# Altium project AMC_FMC_Carrier.PrjPcb (part 1 of 7)
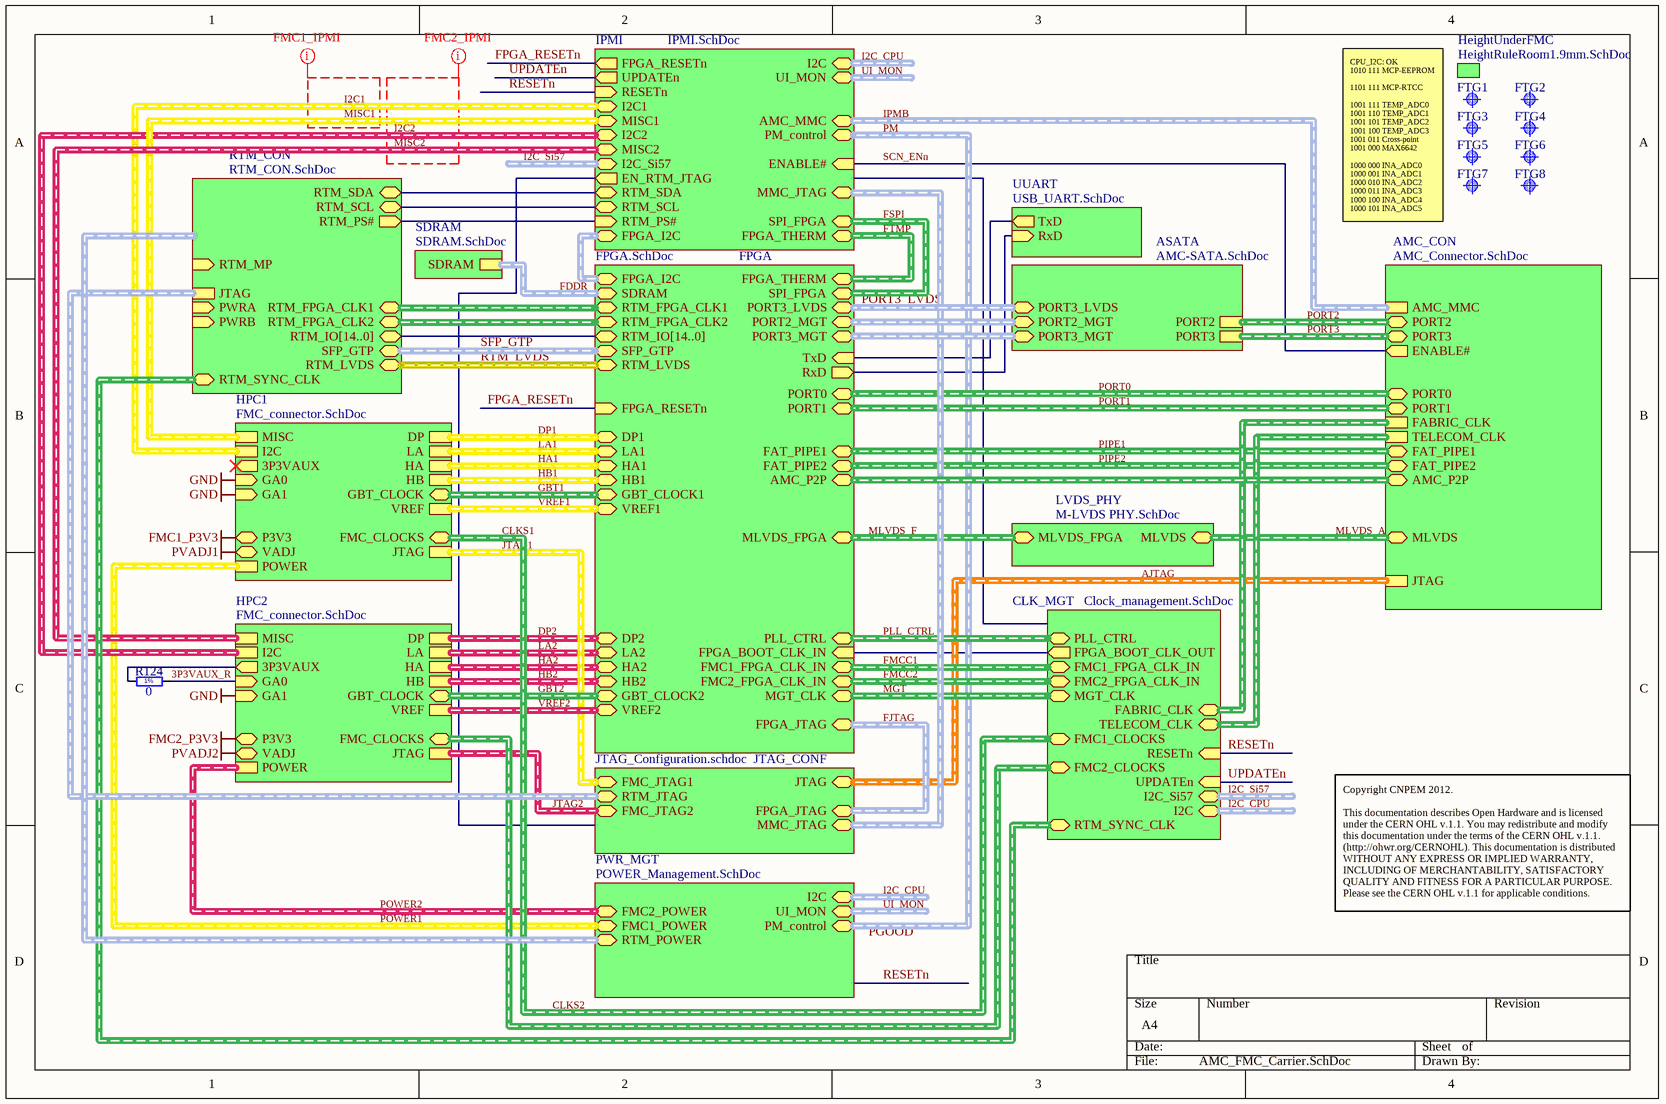
[diagram p0: AMC_FMC_Carrier.SchDoc]
21 sheets, 680 parts. Net scope: hierarchical (ports join the sheet entries above them; power ports are global).
Board file: AMC_FMC_Carrier.PcbDoc
Sheets:
  AMC_FMC_Carrier.SchDoc
    AMC_CON = AMC_Connector.SchDoc
    FPGA = FPGA.SchDoc
      FSDRAM = FPGA_SDRAM.SchDoc
    PWR_MGT = Power_Management.SchDoc
      SUP_HPC25 = SUP_2.5_FMC.SchDoc
      SUP_HPC33 = SUP_3.3_FMC.SchDoc
      SUP_15 = SUP_1.5_3.3.SchDoc
      SUP_10 = SUP_1V.SchDoc
      UI = UI_mon.SchDoc
      Connector Power = Connector_Power.SchDoc
    IPMI = IPMI.SchDoc
      CPU = CPU.SchDoc
      THERMO = Thermometers.SchDoc
      UUART = USB_UART.SchDoc
    JTAG_CONF = JTAG_Configuration.SchDoc
    RTM_CON = RTM_CON.SchDoc
    CLK_MGT = Clock_management.SchDoc
      CLK_WR = Clock_WR.SchDoc
    UUART = USB_UART.SchDoc
  FMC_Clocks.SchDoc
  SUP_1.5_VTT.SchDoc

## Sheet AMC_FMC_Carrier.SchDoc
size A4; DocumentNumber: 2; SheetNumber: 2; SheetTotal: 30

### Parts
FTG1  Use only in PCB  [FIDUCIAL_TOP_S100-200]  (value not drawn)
FTG2  Use only in PCB  [FIDUCIAL_TOP_C100-200]  (value not drawn)
FTG3  Use only in PCB  [FIDUCIAL_TOP_S100-200]  (value not drawn)
FTG4  Use only in PCB  [FIDUCIAL_TOP_C100-200]  (value not drawn)
FTG5  Use only in PCB  [FIDUCIAL_TOP_S100-200]  (value not drawn)
FTG6  Use only in PCB  [FIDUCIAL_TOP_C100-200]  (value not drawn)
FTG7  Use only in PCB  [FIDUCIAL_TOP_S100-200]  (value not drawn)
FTG8  Use only in PCB  [FIDUCIAL_TOP_C100-200]  (value not drawn)
R124  0  [RESC1005X40N]

### Sub-sheets
AMC_CON = AMC_Connector.SchDoc: JTAG (harness AMC_JTAG), TELECOM_CLK (harness AMC_TELECOM_CLOCK), FABRIC_CLK (harness AMC_FABRIC_CLOCK), AMC_MMC (harness I2C), ENABLE# (out), PORT0 (harness PORT0), PORT1 (harness PORT1), PORT2 (harness PORT2), PORT3 (harness PORT3), FAT_PIPE1 (harness FAT_PIPE1), FAT_PIPE2 (harness FAT_PIPE2), MLVDS (harness MLVDS), AMC_P2P (harness AMC_P2P)
ASATA = AMC-SATA.SchDoc (file not in this document): PORT2 (harness PORT2), PORT3 (harness PORT3), PORT2_MGT (harness PORT2), PORT3_MGT (harness PORT3), PORT3_LVDS (harness PORT3)
CLK_MGT = Clock_management.SchDoc: FABRIC_CLK (harness AMC_FABRIC_CLOCK), TELECOM_CLK (harness AMC_TELECOM_CLOCK), FMC1_CLOCKS (harness FMC_CLOCKS), FMC2_CLOCKS (harness FMC_CLOCKS), MGT_CLK (harness MGT_CLK), FMC1_FPGA_CLK_IN (harness FMC_FPGA_CLK_IN), FMC2_FPGA_CLK_IN (harness FMC_FPGA_CLK_IN), PLL_CTRL (harness PLL_CTRL), RESETn (in), UPDATEn (in), I2C (harness I2C), RTM_SYNC_CLK (harness CLK_DIFF), I2C_Si57 (harness I2C), FPGA_BOOT_CLK_OUT (out)
FPGA = FPGA.SchDoc: SDRAM (harness DDR), FPGA_JTAG (harness FMC_J1_JTAG), VREF2 (harness FMC_J1_VREF), VREF1 (harness FMC_J1_VREF), FPGA_THERM (harness FPGA_THERM), SPI_FPGA (harness SPI), FAT_PIPE1, FAT_PIPE2, PORT1, PORT0, MLVDS_FPGA, GBT_CLOCK1, GBT_CLOCK2, MGT_CLK, FMC1_FPGA_CLK_IN, FMC2_FPGA_CLK_IN, PLL_CTRL (harness PLL_CTRL), FPGA_RESETn (in), LA1, HA1, HB1, LA2, HA2, HB2, DP1, DP2, PORT2_MGT (harness PORT2), PORT3_MGT (harness PORT3), RxD (out), TxD (in), RTM_IO[14..0] (bidir), RTM_LVDS (harness RTM_LVDS), SFP_GTP (harness SFP_GTP), RTM_FPGA_CLK1 (harness CLK_DIFF), RTM_FPGA_CLK2 (harness CLK_DIFF), PORT3_LVDS (harness PORT3), AMC_P2P (harness AMC_P2P), FPGA_I2C (harness I2C), FPGA_BOOT_CLK_IN (in)
HeightUnderFMC = HeightRuleRoom1.9mm.SchDoc (file not in this document): no entries
HPC1 = FMC_connector.SchDoc (file not in this document): DP (harness FMC_J1_DP), LA (harness FMC_J1_LA), HA (harness FMC_J1_HA), HB (harness FMC_J1_HB), MISC (harness MISC), POWER (harness FMC_J1_POWER), JTAG (harness FMC_J1_JTAG), I2C (harness I2C), GA0 (in), GA1 (in), 3P3VAUX (out), VREF (harness FMC_J1_VREF), FMC_CLOCKS (harness FMC_CLOCKS), GBT_CLOCK (harness GBT_CLOCK), VADJ, P3V3
HPC2 = FMC_connector.SchDoc (file not in this document): DP (harness FMC_J1_DP), LA (harness FMC_J1_LA), HA (harness FMC_J1_HA), HB (harness FMC_J1_HB), MISC (harness MISC), POWER (harness FMC_J1_POWER), JTAG (harness FMC_J1_JTAG), I2C (harness I2C), VREF (harness FMC_J1_VREF), GA0 (in), GA1 (in), 3P3VAUX (out), FMC_CLOCKS (harness FMC_CLOCKS), GBT_CLOCK (harness GBT_CLOCK), VADJ, P3V3
IPMI = IPMI.SchDoc: I2C1 (harness I2C), I2C2 (harness I2C), MISC1 (harness MISC), MISC2 (harness MISC), PM_control (harness pm_control), FPGA_THERM (harness FPGA_THERM), SPI_FPGA (harness SPI), ENABLE# (in), UPDATEn (out), RESETn (in), I2C (harness I2C), FPGA_RESETn (out), RTM_SDA (bidir), RTM_SCL (bidir), RTM_PS# (in), EN_RTM_JTAG (out), I2C_Si57 (harness I2C), FPGA_I2C (harness I2C), MMC_JTAG, AMC_MMC (harness AMC_MMC), UI_MON
JTAG_CONF = JTAG_Configuration.schdoc: FMC_JTAG1 (harness FMC_J1_JTAG), FMC_JTAG2 (harness FMC_J1_JTAG), JTAG (harness AMC_JTAG), RTM_JTAG (harness RTM_JTAG), MMC_JTAG (harness MMC_JTAG), FPGA_JTAG (harness FPGA_JTAG)
LVDS_PHY = M-LVDS PHY.SchDoc (file not in this document): MLVDS (harness MLVDS), MLVDS_FPGA (harness MLVDS-FPGA)
PWR_MGT = POWER_Management.SchDoc: FMC1_POWER, FMC2_POWER, PM_control (harness PM_control), I2C (harness I2C), RTM_POWER, UI_MON
RTM_CON = RTM_CON.SchDoc: RTM_IO[14..0] (bidir, harness JTAG), RTM_LVDS (harness RTM_LVDS), PWRA (in), PWRB (in), RTM_PS# (out), RTM_SDA (bidir), RTM_SCL (bidir), RTM_MP (in), RTM_SYNC_CLK (harness CLK_DIFF), SFP_GTP (harness SFP_GTP), JTAG (harness FMC_J1_JTAG), RTM_FPGA_CLK1 (harness CLK_DIFF), RTM_FPGA_CLK2 (harness CLK_DIFF)
SDRAM = SDRAM.SchDoc (file not in this document): SDRAM (harness DDR)
UUART = USB_UART.SchDoc: TxD (out), RxD (in)

### Nets
GND: sheet HPC1/GA0, sheet HPC1/GA1, sheet HPC2/GA1
3P3VAUX_R: R124.2 ; sheet HPC2/GA0
FPGA_BOOT_CLK_IN: sheet FPGA/FPGA_BOOT_CLK_IN, sheet CLK_MGT/FPGA_BOOT_CLK_OUT
FPGA_RESETn: sheet FPGA/FPGA_RESETn, sheet IPMI/FPGA_RESETn
RESETn: sheet IPMI/RESETn, sheet CLK_MGT/RESETn
RTM_PS#: sheet IPMI/RTM_PS#, sheet RTM_CON/RTM_PS#
RTM_SCL: sheet IPMI/RTM_SCL, sheet RTM_CON/RTM_SCL
RTM_SDA: sheet IPMI/RTM_SDA, sheet RTM_CON/RTM_SDA
RxD: sheet FPGA/RxD, sheet UUART/RxD
SCN_ENn: sheet AMC_CON/ENABLE#, sheet IPMI/ENABLE#
TxD: sheet FPGA/TxD, sheet UUART/TxD
UPDATEn: sheet IPMI/UPDATEn, sheet CLK_MGT/UPDATEn
NetR124_1: R124.1 ; sheet HPC2/3P3VAUX

### Buses and harness runs
harness AJTAG = sheet AMC_CON/JTAG = sheet JTAG_CONF/JTAG
harness CLKS1 = CLKS2 = sheet CLK_MGT/FMC1_CLOCKS = sheet HPC1/FMC_CLOCKS
harness DP1 = sheet FPGA/DP1 = sheet HPC1/DP
harness DP2 = sheet FPGA/DP2 = sheet HPC2/DP
harness FDDR = sheet FPGA/SDRAM = sheet SDRAM/SDRAM
harness FJTAG = sheet FPGA/FPGA_JTAG = sheet JTAG_CONF/FPGA_JTAG
harness FMCC1 = sheet CLK_MGT/FMC1_FPGA_CLK_IN = sheet FPGA/FMC1_FPGA_CLK_IN
harness FMCC2 = sheet CLK_MGT/FMC2_FPGA_CLK_IN = sheet FPGA/FMC2_FPGA_CLK_IN
harness FSPI = sheet FPGA/SPI_FPGA = sheet IPMI/SPI_FPGA
harness FTMP = sheet FPGA/FPGA_THERM = sheet IPMI/FPGA_THERM
harness GBT1 = sheet FPGA/GBT_CLOCK1 = sheet HPC1/GBT_CLOCK
harness GBT2 = sheet FPGA/GBT_CLOCK2 = sheet HPC2/GBT_CLOCK
harness HA1 = sheet FPGA/HA1 = sheet HPC1/HA
harness HA2 = sheet FPGA/HA2 = sheet HPC2/HA
harness HB1 = sheet FPGA/HB1 = sheet HPC1/HB
harness HB2 = sheet FPGA/HB2 = sheet HPC2/HB
harness I2C1 = sheet HPC1/I2C = sheet IPMI/I2C1
harness I2C2 = sheet HPC2/I2C = sheet IPMI/I2C2
harness I2C_CPU = sheet CLK_MGT/I2C
harness I2C_CPU = sheet IPMI/I2C
harness I2C_CPU = sheet PWR_MGT/I2C
harness I2C_Si57 = sheet CLK_MGT/I2C_Si57
harness I2C_Si57 = sheet IPMI/I2C_Si57
harness IPMB = sheet AMC_CON/AMC_MMC = sheet IPMI/AMC_MMC
harness JTAG1 = sheet HPC1/JTAG = sheet JTAG_CONF/FMC_JTAG1
harness JTAG2 = sheet HPC2/JTAG = sheet JTAG_CONF/FMC_JTAG2
harness LA1 = sheet FPGA/LA1 = sheet HPC1/LA
harness LA2 = sheet FPGA/LA2 = sheet HPC2/LA
harness MGT = sheet CLK_MGT/MGT_CLK = sheet FPGA/MGT_CLK
harness MISC1 = sheet HPC1/MISC = sheet IPMI/MISC1
harness MISC2 = sheet HPC2/MISC = sheet IPMI/MISC2
harness MLVDS_A = sheet AMC_CON/MLVDS = sheet LVDS_PHY/MLVDS
harness MLVDS_F = sheet FPGA/MLVDS_FPGA = sheet LVDS_PHY/MLVDS_FPGA
harness PIPE1 = sheet AMC_CON/FAT_PIPE1 = sheet FPGA/FAT_PIPE1
harness PIPE2 = sheet AMC_CON/FAT_PIPE2 = sheet FPGA/FAT_PIPE2
harness PLL_CTRL = sheet CLK_MGT/PLL_CTRL = sheet FPGA/PLL_CTRL
harness PM = sheet IPMI/PM_control = sheet PWR_MGT/PM_control
harness PORT0 = sheet AMC_CON/PORT0 = sheet FPGA/PORT0
harness PORT1 = sheet AMC_CON/PORT1 = sheet FPGA/PORT1
harness PORT2 = sheet AMC_CON/PORT2 = sheet ASATA/PORT2
harness PORT3 = sheet AMC_CON/PORT3 = sheet ASATA/PORT3
harness PORT3_LVDS = sheet ASATA/PORT3_LVDS = sheet FPGA/PORT3_LVDS
harness POWER1 = sheet HPC1/POWER = sheet PWR_MGT/FMC1_POWER
harness POWER2 = sheet HPC2/POWER = sheet PWR_MGT/FMC2_POWER
harness RTM_LVDS = sheet FPGA/RTM_LVDS = sheet RTM_CON/RTM_LVDS
harness SFP_GTP = sheet FPGA/SFP_GTP = sheet RTM_CON/SFP_GTP
harness sheet AMC_CON/AMC_P2P = sheet FPGA/AMC_P2P
harness sheet AMC_CON/FABRIC_CLK = sheet CLK_MGT/FABRIC_CLK
harness sheet AMC_CON/TELECOM_CLK = sheet CLK_MGT/TELECOM_CLK
harness sheet ASATA/PORT2_MGT = sheet FPGA/PORT2_MGT
harness sheet ASATA/PORT3_MGT = sheet FPGA/PORT3_MGT
harness sheet CLK_MGT/FMC2_CLOCKS = sheet HPC2/FMC_CLOCKS
harness sheet CLK_MGT/RTM_SYNC_CLK = sheet RTM_CON/RTM_SYNC_CLK
harness sheet FPGA/FPGA_I2C = sheet IPMI/FPGA_I2C
harness sheet FPGA/RTM_FPGA_CLK1 = sheet RTM_CON/RTM_FPGA_CLK1
harness sheet FPGA/RTM_FPGA_CLK2 = sheet RTM_CON/RTM_FPGA_CLK2
harness sheet IPMI/MMC_JTAG = sheet JTAG_CONF/MMC_JTAG
harness sheet JTAG_CONF/RTM_JTAG = sheet RTM_CON/JTAG
harness UI_MON = sheet IPMI/UI_MON
harness UI_MON = sheet PWR_MGT/UI_MON
harness VREF1 = sheet FPGA/VREF1 = sheet HPC1/VREF
harness VREF2 = sheet FPGA/VREF2 = sheet HPC2/VREF

### Layout directives
net class FMC1_IPMI: I2C1, MISC1
net class FMC2_IPMI: I2C2, MISC2

### Notes on the sheet
- CPU_I2C: OK
  1010 111 MCP-EEPROM
  1101 111 MCP-RTCC
  1001 111 TEMP_ADC0
  1001 110 TEMP_ADC1
  1001 101 TEMP_ADC2
  1001 100 TEMP_ADC3
  1001 011 Cross-point
  1001 000 MAX6642
  1000 000 INA_ADC0
  1000 001 INA_ADC1
  1000 010 INA_ADC2
  1000 011 INA_ADC3
  1000 100 INA_ADC4
  1000 101 INA_ADC5
- Copyright CNPEM 2012.
  This documentation describes Open Hardware and is licensed under the CERN OHL v.1.1. You may redistribute and modify this documentation under the terms of the CERN OHL v.1.1. (http://ohwr.org/CERNOHL). This documentation is distributed WITHOUT ANY EXPRESS OR IMPLIED WARRANTY, INCLUDING OF MERCHANTABILITY, SATISFACTORY QUALITY AND FITNESS FOR A PARTICULAR PURPOSE. Please see the CERN OHL v.1.1 for applicable conditions.
- Labels drawn without touching a wire or pin: PGOOD
- (in symbol R0402_0R_JUMPER) 1%

### Library data of the parts
FTG1 FTG3 FTG5 FTG7 = FIDUCIAL_TARGET_S100-200: Fiducial Target; Part Description: Square Fiducial Target, Top Layer, 1.0mm, Top Solder 2.0mm, Keepout =2.0mm; Mounted: No; Table: Pads; Part Number: FIDUCIAL_TARGET_S100-200; Component Kind: Standard (No BOM); Component Type: Standard (No BOM); Pin Count: 1; Family: Fiducial; Socket: No; SMD: Yes; Status: None; ComponentHeight: 0mm; Author: CERN DEM JLC; CreateDate: 2010-02-09; LatestRevisionDate: 2012-04-04; PackageDescription: Square Fiducial Target, Top Layer, 1.0mm, Top Solder 2.0mm, Keepout =2.0mm
FTG2 FTG4 FTG6 FTG8 = FIDUCIAL_TARGET_C100-200: Fiducial Target; Part Description: Round Fiducial Target, Top Layer, 1.0mm, Top Solder 2.0mm, Keepout =2.0mm; Mounted: No; Table: Pads; Part Number: FIDUCIAL_TARGET_C100-200; Component Kind: Standard (No BOM); Component Type: Standard (No BOM); Pin Count: 1; Family: Fiducial; Socket: No; SMD: Yes; Status: None; ComponentHeight: 0mm; Author: CERN DEM JLC; CreateDate: 2010-02-09; LatestRevisionDate: 2012-04-04; PackageDescription: Round Fiducial Target, Top Layer, 1.0mm, Top Solder 2.0mm, Keepout =2.0mm
R124 = R0402_0R_JUMPER: Resistor - 1%; Part Description: 1A (0.05R Max DC Resistance) Zero Ohm Jumper; Manufacturer: GENERIC; Manufacturer1 Part Number: 232270591001L; Table: Resistors SMD; Part Number: R0402_0R_JUMPER; Component Kind: Standard; Component Type: Standard; Pin Count: 2; Value: 0; Status: Not recommended; Manufacturer Part Number: R0402_0R_JUMPER; Case: 0402; Mounted: Yes; Socket: No; SMD: Yes; Manufacturer1 Example: YAGEO PHYCOMP; Manufacturer1 ComponentHeight: 0.4mm; HelpURL: \\cern.ch\dfs\Applications\Altium\Datasheets\R0402_Phycomp_RC0402.pdf; Author: CERN DEM JLC; CreateDate: 2007-12-03; LatestRevisionDate: 2012-10-17

## Sheet AMC_Connector.SchDoc: AMC Top Sheet
size A3; DocumentNumber: 1; Revision: 5; SheetNumber: 1; SheetTotal: 30; Organization: Altium Limited.
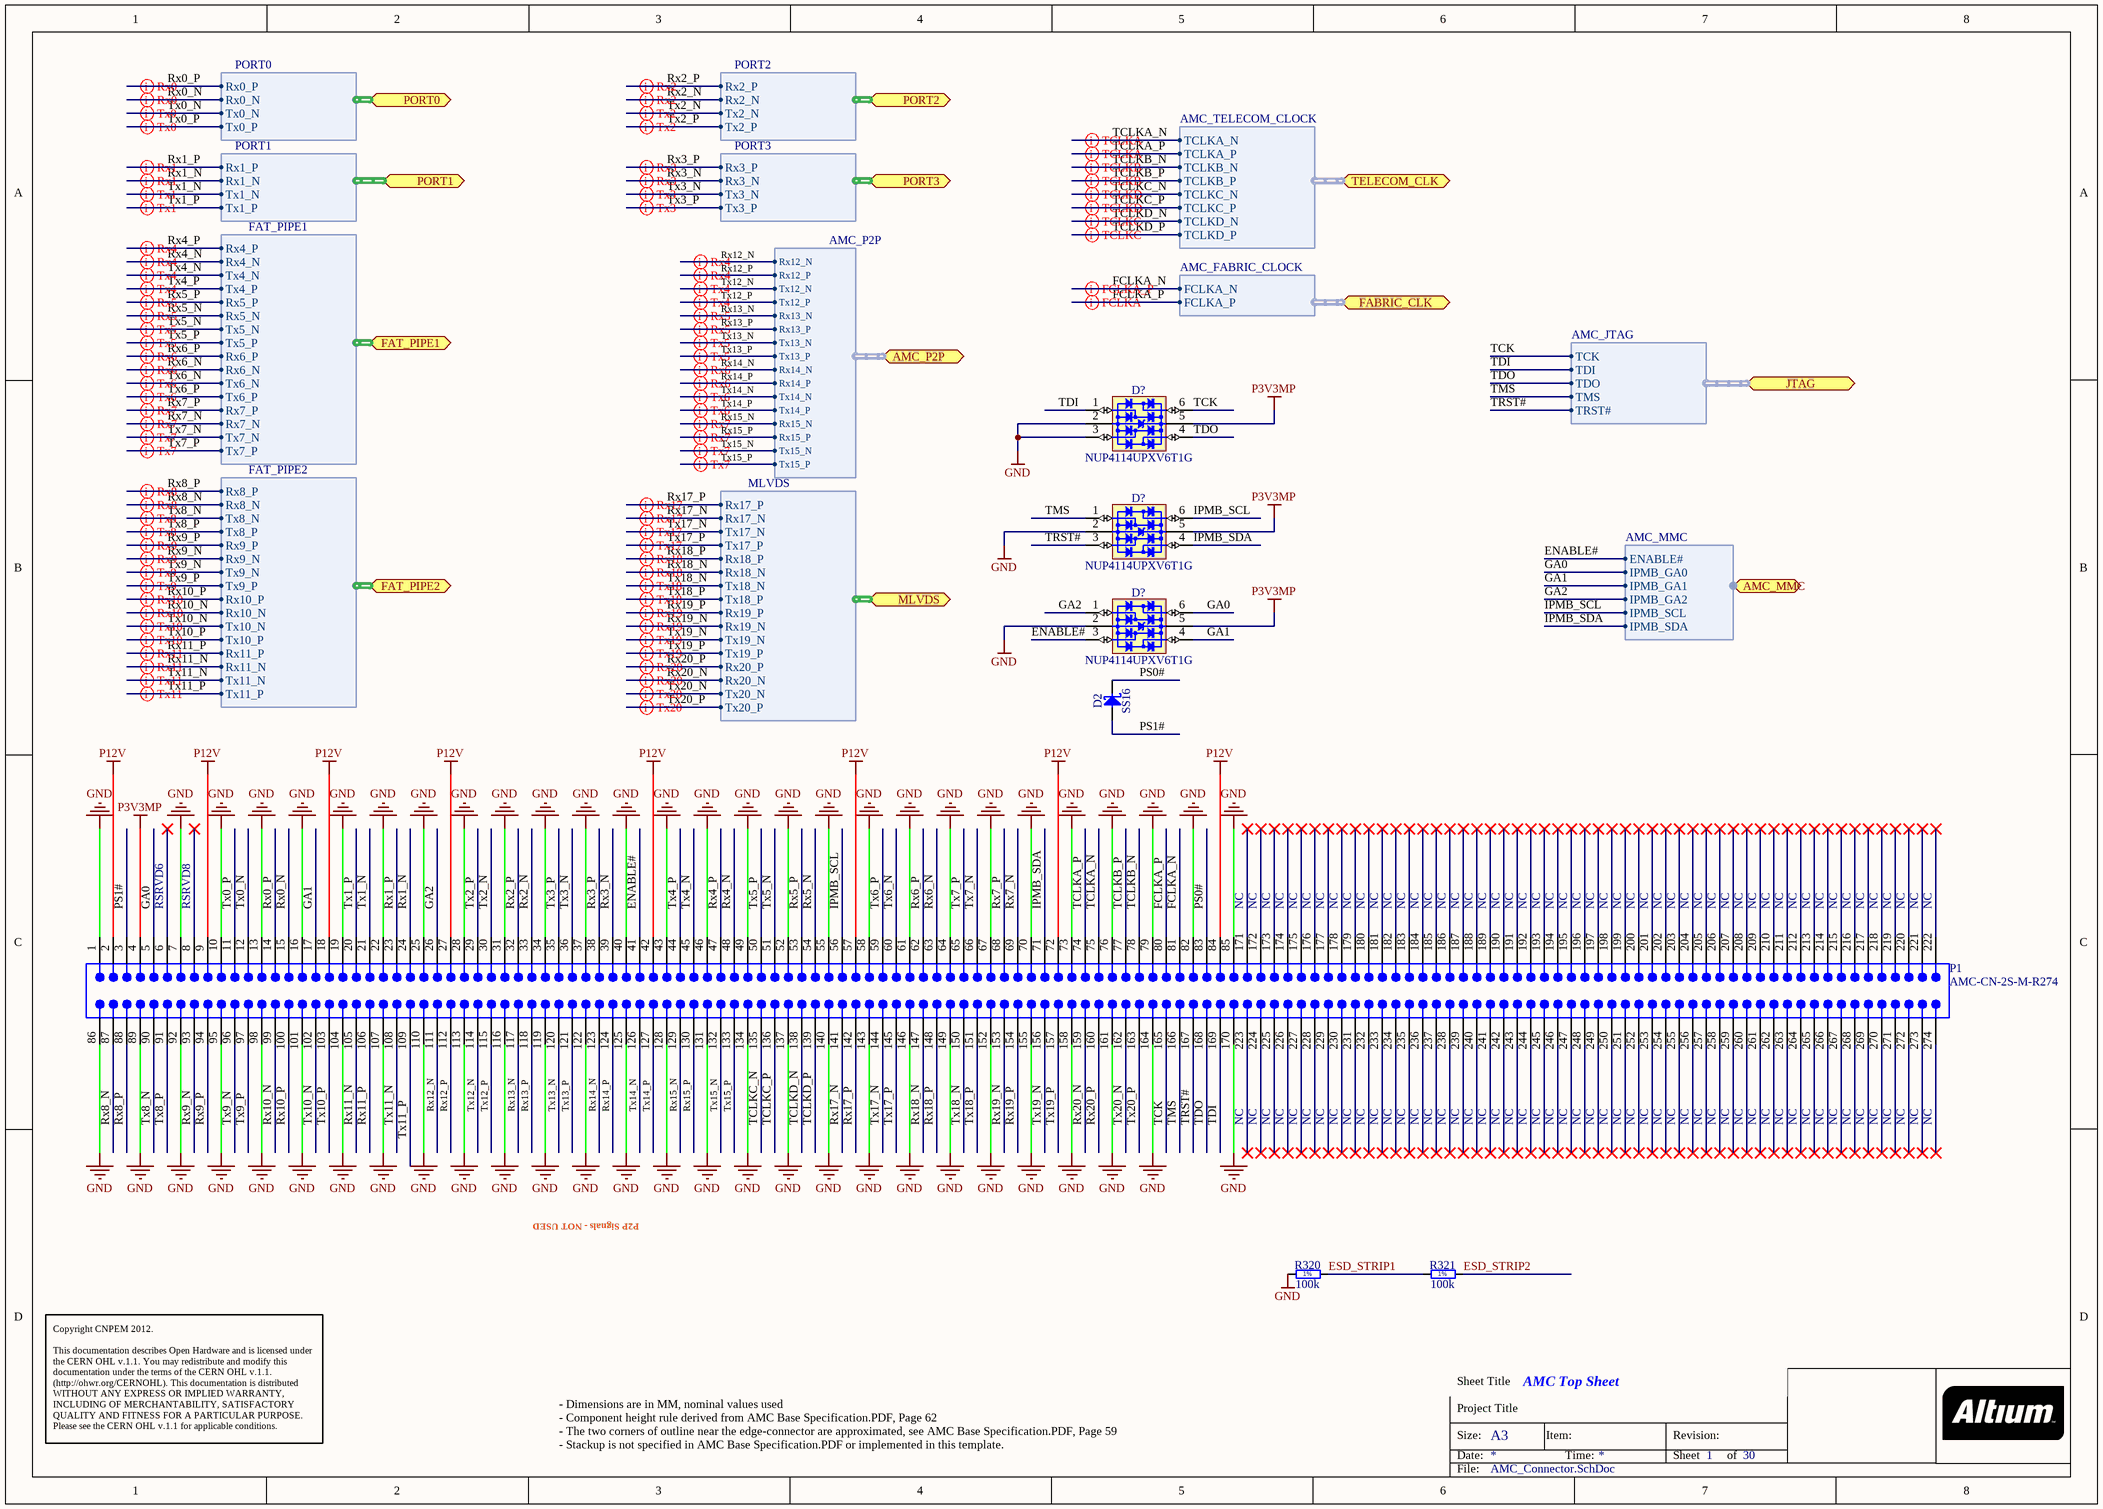
[diagram p1: AMC_Connector.SchDoc]

### Parts
(Parts that share a designator on the sheet are numbered #1, #2 ... from top to bottom, then left to right.)
D2#1  SS16  [DIOM5127X229N]
D?#1  NUP4114UPXV6T1G  [SOTFL50P160X60-6N]
D?#2  NUP4114UPXV6T1G  [SOTFL50P160X60-6N]
D?#3  NUP4114UPXV6T1G  [SOTFL50P160X60-6N]
P1  AMC-CN-2S-M-R274  [AMC-GF-2D-750-O274]  (no BOM)
R320  100k  [RESC3216X65N]
R321  100k  [RESC3216X65N]

### Ports
AMC_MMC (harness AMC_MMC), AMC_P2P (harness AMC_P2P), FABRIC_CLK (harness AMC_FABRIC_CLOCK), FAT_PIPE1 (harness FAT_PIPE1), FAT_PIPE2 (harness FAT_PIPE2), JTAG (harness AMC_JTAG), MLVDS (harness MLVDS), PORT0 (harness PORT0), PORT1 (harness PORT1), PORT2 (harness PORT2), PORT3 (harness PORT3), TELECOM_CLK (harness AMC_TELECOM_CLOCK)

### Harnesses
AMC_JTAG: TCK, TDI, TDO, TMS, TRST#
AMC_TELECOM_CLOCK: TCLKA_N, TCLKA_P, TCLKB_N, TCLKB_P, TCLKC_N, TCLKC_P, TCLKD_N, TCLKD_P
AMC_FABRIC_CLOCK: FCLKA_N, FCLKA_P
PORT0: Rx0_P, Rx0_N, Tx0_N, Tx0_P
PORT1: Rx1_P, Rx1_N, Tx1_N, Tx1_P
FAT_PIPE1: Rx4_P, Rx4_N, Tx4_N, Tx4_P, Rx5_P, Rx5_N, Tx5_N, Tx5_P, Rx6_P, Rx6_N, Tx6_N, Tx6_P, Rx7_P, Rx7_N, Tx7_N, Tx7_P
FAT_PIPE2: Rx8_P, Rx8_N, Tx8_N, Tx8_P, Rx9_P, Rx9_N, Tx9_N, Tx9_P, Rx10_P, Rx10_N, Tx10_N, Tx10_P, Rx11_P, Rx11_N, Tx11_N, Tx11_P
MLVDS: Rx17_P, Rx17_N, Tx17_N, Tx17_P, Rx18_P, Rx18_N, Tx18_N, Tx18_P, Rx19_P, Rx19_N, Tx19_N, Tx19_P, Rx20_P, Rx20_N, Tx20_N, Tx20_P
PORT2: Rx2_P, Rx2_N, Tx2_N, Tx2_P
PORT3: Rx3_P, Rx3_N, Tx3_N, Tx3_P
AMC_P2P: Rx12_N, Rx12_P, Tx12_N, Tx12_P, Rx13_N, Rx13_P, Tx13_N, Tx13_P, Rx14_N, Rx14_P, Tx14_N, Tx14_P, Rx15_N, Rx15_P, Tx15_N, Tx15_P
AMC_MMC: ENABLE#, IPMB_GA0, IPMB_GA1, IPMB_GA2, IPMB_SCL, IPMB_SDA

### Nets
GND: D?#1.2(GND) D?#1.3(I/O2) D?#2.2(GND) D?#3.2(GND) P1.1 P1.7 P1.10 P1.13 P1.16 P1.19 P1.22 P1.25 P1.28 P1.31 P1.34 P1.37 P1.40 P1.43 P1.46 P1.49 P1.52 P1.55 P1.58 P1.61 P1.64 P1.67 P1.70 P1.73 P1.76 P1.79 P1.82 P1.85 P1.86 P1.89 P1.92 P1.95 P1.98 P1.101 P1.104 P1.107 P1.110 P1.113 P1.116 P1.119 P1.122 P1.125 P1.128 P1.131 P1.134 P1.137 P1.140 P1.143 P1.146 P1.149 P1.152 P1.155 P1.158 P1.161 P1.164 P1.170 R320.1
P3V3MP: D?#1.5(VBUS) D?#2.5(VBUS) D?#3.5(VBUS) P1.4
P12V: P1.2 P1.9 P1.18 P1.27 P1.42 P1.57 P1.72 P1.84
ENABLE#: D?#3.3(I/O2) P1.41 ; port AMC_MMC.ENABLE#  [project net IPMB.ENABLE#]
ESD_STRIP1: R320.2 R321.1
ESD_STRIP2: R321.2
FCLKA_N: P1.81 ; port FABRIC_CLK.FCLKA_N
FCLKA_P: P1.80 ; port FABRIC_CLK.FCLKA_P
GA0: D?#3.6(I/O4) P1.5 ; port AMC_MMC.IPMB_GA0  [project net IPMB.IPMB_GA0]
GA1: D?#3.4(I/O3) P1.17 ; port AMC_MMC.IPMB_GA1  [project net IPMB.IPMB_GA1]
GA2: D?#3.1(I/O1) P1.26 ; port AMC_MMC.IPMB_GA2  [project net IPMB.IPMB_GA2]
IPMB_SCL: D?#2.6(I/O4) P1.56 ; port AMC_MMC.IPMB_SCL  [project net IPMB.IPMB_SCL]
IPMB_SDA: D?#2.4(I/O3) P1.71 ; port AMC_MMC.IPMB_SDA  [project net IPMB.IPMB_SDA]
PS0#: D2#1.1(C) P1.83
PS1#: D2#1.2(A) P1.3
Rx0_N: P1.15 ; port PORT0.Rx0_N  [project net PORT0.Rx0_N]
Rx0_P: P1.14 ; port PORT0.Rx0_P  [project net PORT0.Rx0_P]
Rx1_N: P1.24 ; port PORT1.Rx1_N  [project net PORT1.Rx1_N]
Rx1_P: P1.23 ; port PORT1.Rx1_P  [project net PORT1.Rx1_P]
Rx2_N: P1.33 ; port PORT2.Rx2_N  [project net PORT2.Rx2_N]
Rx2_P: P1.32 ; port PORT2.Rx2_P  [project net PORT2.Rx2_P]
Rx3_N: P1.39 ; port PORT3.Rx3_N  [project net PORT3.Rx3_N]
Rx3_P: P1.38 ; port PORT3.Rx3_P  [project net PORT3.Rx3_P]
Rx4_N: P1.48 ; port FAT_PIPE1.Rx4_N  [project net PIPE1.Rx4_N]
Rx4_P: P1.47 ; port FAT_PIPE1.Rx4_P  [project net PIPE1.Rx4_P]
Rx5_N: P1.54 ; port FAT_PIPE1.Rx5_N  [project net PIPE1.Rx5_N]
Rx5_P: P1.53 ; port FAT_PIPE1.Rx5_P  [project net PIPE1.Rx5_P]
Rx6_N: P1.63 ; port FAT_PIPE1.Rx6_N  [project net PIPE1.Rx6_N]
Rx6_P: P1.62 ; port FAT_PIPE1.Rx6_P  [project net PIPE1.Rx6_P]
Rx7_N: P1.69 ; port FAT_PIPE1.Rx7_N  [project net PIPE1.Rx7_N]
Rx7_P: P1.68 ; port FAT_PIPE1.Rx7_P  [project net PIPE1.Rx7_P]
Rx8_N: P1.87 ; port FAT_PIPE2.Rx8_N  [project net PIPE2.Rx8_N]
Rx8_P: P1.88 ; port FAT_PIPE2.Rx8_P  [project net PIPE2.Rx8_P]
Rx9_N: P1.93 ; port FAT_PIPE2.Rx9_N  [project net PIPE2.Rx9_N]
Rx9_P: P1.94 ; port FAT_PIPE2.Rx9_P  [project net PIPE2.Rx9_P]
Rx10_N: P1.99 ; port FAT_PIPE2.Rx10_N  [project net PIPE2.Rx10_N]
Rx10_P: P1.100 ; port FAT_PIPE2.Rx10_P  [project net PIPE2.Rx10_P]
Rx11_N: P1.105 ; port FAT_PIPE2.Rx11_N  [project net PIPE2.Rx11_N]
Rx11_P: P1.106 ; port FAT_PIPE2.Rx11_P  [project net PIPE2.Rx11_P]
Rx12_N: P1.111 ; port AMC_P2P.Rx12_N
Rx12_P: P1.112 ; port AMC_P2P.Rx12_P
Rx13_N: P1.117 ; port AMC_P2P.Rx13_N
Rx13_P: P1.118 ; port AMC_P2P.Rx13_P
Rx14_N: P1.123 ; port AMC_P2P.Rx14_N
Rx14_P: P1.124 ; port AMC_P2P.Rx14_P
Rx15_N: P1.129 ; port AMC_P2P.Rx15_N
Rx15_P: P1.130 ; port AMC_P2P.Rx15_P
Rx17_N: P1.141 ; port MLVDS.Rx17_N  [project net MLVDS_A.Rx17_N]
Rx17_P: P1.142 ; port MLVDS.Rx17_P  [project net MLVDS_A.Rx17_P]
Rx18_N: P1.147 ; port MLVDS.Rx18_N  [project net MLVDS_A.Rx18_N]
Rx18_P: P1.148 ; port MLVDS.Rx18_P  [project net MLVDS_A.Rx18_P]
Rx19_N: P1.153 ; port MLVDS.Rx19_N  [project net MLVDS_A.Rx19_N]
Rx19_P: P1.154 ; port MLVDS.Rx19_P  [project net MLVDS_A.Rx19_P]
Rx20_N: P1.159 ; port MLVDS.Rx20_N  [project net MLVDS_A.Rx20_N]
Rx20_P: P1.160 ; port MLVDS.Rx20_P  [project net MLVDS_A.Rx20_P]
TCK: D?#1.6(I/O4) P1.165 ; port JTAG.TCK  [project net AJTAG.TCK]
TCLKA_N: P1.75 ; port TELECOM_CLK.TCLKA_N
TCLKA_P: P1.74 ; port TELECOM_CLK.TCLKA_P
TCLKB_N: P1.78 ; port TELECOM_CLK.TCLKB_N
TCLKB_P: P1.77 ; port TELECOM_CLK.TCLKB_P
TCLKC_N: P1.135 ; port TELECOM_CLK.TCLKC_N
TCLKC_P: P1.136 ; port TELECOM_CLK.TCLKC_P
TCLKD_N: P1.138 ; port TELECOM_CLK.TCLKD_N
TCLKD_P: P1.139 ; port TELECOM_CLK.TCLKD_P
TDI: D?#1.1(I/O1) P1.169 ; port JTAG.TDI  [project net AJTAG.TDI]
TDO: D?#1.4(I/O3) P1.168 ; port JTAG.TDO  [project net AJTAG.TDO]
TMS: D?#2.1(I/O1) P1.166 ; port JTAG.TMS  [project net AJTAG.TMS]
TRST#: D?#2.3(I/O2) P1.167 ; port JTAG.TRST#  [project net AJTAG.TRST#]
Tx0_N: P1.12 ; port PORT0.Tx0_N  [project net PORT0.Tx0_N]
Tx0_P: P1.11 ; port PORT0.Tx0_P  [project net PORT0.Tx0_P]
Tx1_N: P1.21 ; port PORT1.Tx1_N  [project net PORT1.Tx1_N]
Tx1_P: P1.20 ; port PORT1.Tx1_P  [project net PORT1.Tx1_P]
Tx2_N: P1.30 ; port PORT2.Tx2_N  [project net PORT2.Tx2_N]
Tx2_P: P1.29 ; port PORT2.Tx2_P  [project net PORT2.Tx2_P]
Tx3_N: P1.36 ; port PORT3.Tx3_N  [project net PORT3.Tx3_N]
Tx3_P: P1.35 ; port PORT3.Tx3_P  [project net PORT3.Tx3_P]
Tx4_N: P1.45 ; port FAT_PIPE1.Tx4_N  [project net PIPE1.Tx4_N]
Tx4_P: P1.44 ; port FAT_PIPE1.Tx4_P  [project net PIPE1.Tx4_P]
Tx5_N: P1.51 ; port FAT_PIPE1.Tx5_N  [project net PIPE1.Tx5_N]
Tx5_P: P1.50 ; port FAT_PIPE1.Tx5_P  [project net PIPE1.Tx5_P]
Tx6_N: P1.60 ; port FAT_PIPE1.Tx6_N  [project net PIPE1.Tx6_N]
Tx6_P: P1.59 ; port FAT_PIPE1.Tx6_P  [project net PIPE1.Tx6_P]
Tx7_N: P1.66 ; port FAT_PIPE1.Tx7_N  [project net PIPE1.Tx7_N]
Tx7_P: P1.65 ; port FAT_PIPE1.Tx7_P  [project net PIPE1.Tx7_P]
Tx8_N: P1.90 ; port FAT_PIPE2.Tx8_N  [project net PIPE2.Tx8_N]
Tx8_P: P1.91 ; port FAT_PIPE2.Tx8_P  [project net PIPE2.Tx8_P]
Tx9_N: P1.96 ; port FAT_PIPE2.Tx9_N  [project net PIPE2.Tx9_N]
Tx9_P: P1.97 ; port FAT_PIPE2.Tx9_P  [project net PIPE2.Tx9_P]
Tx10_N: P1.102 ; port FAT_PIPE2.Tx10_N  [project net PIPE2.Tx10_N]
Tx10_P: P1.103 ; port FAT_PIPE2.Tx10_P  [project net PIPE2.Tx10_P]
Tx11_N: P1.108 ; port FAT_PIPE2.Tx11_N  [project net PIPE2.Tx11_N]
Tx11_P: P1.109 ; port FAT_PIPE2.Tx11_P  [project net PIPE2.Tx11_P]
Tx12_N: P1.114 ; port AMC_P2P.Tx12_N
Tx12_P: P1.115 ; port AMC_P2P.Tx12_P
Tx13_N: P1.120 ; port AMC_P2P.Tx13_N
Tx13_P: P1.121 ; port AMC_P2P.Tx13_P
Tx14_N: P1.126 ; port AMC_P2P.Tx14_N
Tx14_P: P1.127 ; port AMC_P2P.Tx14_P
Tx15_N: P1.132 ; port AMC_P2P.Tx15_N
Tx15_P: P1.133 ; port AMC_P2P.Tx15_P
Tx17_N: P1.144 ; port MLVDS.Tx17_N  [project net MLVDS_A.Tx17_N]
Tx17_P: P1.145 ; port MLVDS.Tx17_P  [project net MLVDS_A.Tx17_P]
Tx18_N: P1.150 ; port MLVDS.Tx18_N  [project net MLVDS_A.Tx18_N]
Tx18_P: P1.151 ; port MLVDS.Tx18_P  [project net MLVDS_A.Tx18_P]
Tx19_N: P1.156 ; port MLVDS.Tx19_N  [project net MLVDS_A.Tx19_N]
Tx19_P: P1.157 ; port MLVDS.Tx19_P  [project net MLVDS_A.Tx19_P]
Tx20_N: P1.162 ; port MLVDS.Tx20_N  [project net MLVDS_A.Tx20_N]
Tx20_P: P1.163 ; port MLVDS.Tx20_P  [project net MLVDS_A.Tx20_P]

Not connected (* = marked no-connect by the designer): P1 6* 8* 171* 172* 173* 174* 175* 176* 177* 178* 179* 180* 181* 182* 183* 184* 185* 186* 187* 188* 189* 190* 191* 192* 193* 194* 195* 196* 197* 198* 199* 200* 201* 202* 203* 204* 205* 206* 207* 208* 209* 210* 211* 212* 213* 214* 215* 216* 217* 218* 219* 220* 221* 222* 223* 224* 225* 226* 227* 228* 229* 230* 231* 232* 233* 234* 235* 236* 237* 238* 239* 240* 241* 242* 243* 244* 245* 246* 247* 248* 249* 250* 251* 252* 253* 254* 255* 256* 257* 258* 259* 260* 261* 262* 263* 264* 265* 266* 267* 268* 269* 270* 271* 272* 273* 274*

### Layout directives
differential pair: FCLKA_N, FCLKA_P, MLVDS_A.Rx17_N, MLVDS_A.Rx17_P, MLVDS_A.Rx18_N, MLVDS_A.Rx18_P, MLVDS_A.Rx19_N, MLVDS_A.Rx19_P, MLVDS_A.Rx20_N, MLVDS_A.Rx20_P, MLVDS_A.Tx17_N, MLVDS_A.Tx17_P, MLVDS_A.Tx18_N, MLVDS_A.Tx18_P, MLVDS_A.Tx19_N, MLVDS_A.Tx19_P, MLVDS_A.Tx20_N, MLVDS_A.Tx20_P, PIPE1.Rx4_N, PIPE1.Rx4_P, PIPE1.Rx5_N, PIPE1.Rx5_P, PIPE1.Rx6_N, PIPE1.Rx6_P, PIPE1.Rx7_N, PIPE1.Rx7_P, PIPE1.Tx4_N, PIPE1.Tx4_P, PIPE1.Tx5_N, PIPE1.Tx5_P, PIPE1.Tx6_N, PIPE1.Tx6_P, PIPE1.Tx7_N, PIPE1.Tx7_P, PIPE2.Rx8_N, PIPE2.Rx8_P, PIPE2.Rx9_N, PIPE2.Rx9_P, PIPE2.Rx10_N, PIPE2.Rx10_P, PIPE2.Rx11_N, PIPE2.Rx11_P, PIPE2.Tx8_N, PIPE2.Tx8_P, PIPE2.Tx9_N, PIPE2.Tx9_P, PIPE2.Tx10_N, PIPE2.Tx10_P, PIPE2.Tx11_N, PIPE2.Tx11_P, PORT0.Rx0_N, PORT0.Rx0_P, PORT0.Tx0_N, PORT0.Tx0_P, PORT1.Rx1_N, PORT1.Rx1_P, PORT1.Tx1_N, PORT1.Tx1_P, PORT2.Rx2_N, PORT2.Rx2_P, PORT2.Tx2_N, PORT2.Tx2_P, PORT3.Rx3_N, PORT3.Rx3_P, PORT3.Tx3_N, PORT3.Tx3_P, Rx12_N, Rx12_P, Rx13_N, Rx13_P, Rx14_N, Rx14_P, Rx15_N, Rx15_P, TCLKA_N, TCLKA_P, TCLKB_N, TCLKB_P, TCLKC_N, TCLKC_P, TCLKD_N, TCLKD_P, Tx12_N, Tx12_P, Tx13_N, Tx13_P, Tx14_N, Tx14_P, Tx15_N, Tx15_P

### Notes on the sheet
- RSRVD6
- RSRVD8
- NC
- P2P Signals - NOT USED
- Copyright CNPEM 2012.
  This documentation describes Open Hardware and is licensed under the CERN OHL v.1.1. You may redistribute and modify this documentation under the terms of the CERN OHL v.1.1. (http://ohwr.org/CERNOHL). This documentation is distributed WITHOUT ANY EXPRESS OR IMPLIED WARRANTY, INCLUDING OF MERCHANTABILITY, SATISFACTORY QUALITY AND FITNESS FOR A PARTICULAR PURPOSE. Please see the CERN OHL v.1.1 for applicable conditions.
- - Dimensions are in MM, nominal values used
  - Component height rule derived from AMC Base Specification.PDF, Page 62
  - The two corners of outline near the edge-connector are approximated, see AMC Base Specification.PDF, Page 59
  - Stackup is not specified in AMC Base Specification.PDF or implemented in this template.
- Sheet Title
- Project Title
- Size:
- Date:
- A3
- Item:
- Time:
- Revision:
- Sheet
- of
- File:
- (in symbol R1206_100K_1%_0.25W_100PPM) 1%

### Library data of the parts
D2#1 = SS16: Schottky Diode; Part Description: Surface Mount Schottky Barrier Rectifier; Manufacturer: VISHAY GENERAL SEMICONDUCTOR; Voltage: 60V; Power: 1A; Table: Diodes; Part Number: SS16; Component Kind: Standard; Component Type: Standard; Device: SS16; PackageDescription: DO-214-AC Molded Diode, Body 5.1x2.7mm, IPC Medium Density; Manufacturer Part Number: SS16; Pin Count: 2; Case: DO-214AC; Mounted: Yes; Socket: No; SMD: Yes; ComponentHeight: 2.29mm; HelpURL: \\cern.ch\dfs\Applications\Altium\Datasheets\SS16.pdf; Author: CERN DEM JLC; CreateDate: 2008-07-15; LatestRevisionDate: 2010-08-23
D?#1-D?#3 = NUP4114UPXV6T1G: Part Description: ESD Protection Diodes Array (8kV) with Low Clamping Voltage; Manufacturer: ON SEMICONDUCTOR; Voltage: 5.5V; PressFit: No; Bonding: No; Part Number: NUP4114UPXV6T1G; Component Kind: Standard; Component Type: Standard; Device: NUP4114UPXV6T1G; PackageDescription: SOTFL (SOT666, SOT563,), 0.50mm, Pitch; 6 Pin, 1.20mm W X 1.60mm L X 0.60mm H Body, IPC Medium Density; Manufacturer Part Number: NUP4114UPXV6T1G; Pin Count: 8; Mounted: Yes; Socket: No; SMD: Yes; Sense: No; ComponentHeight: 1.75mm; HelpURL: \\cern.ch\dfs\Applications\Altium\Datasheets\NUP4114UPXV6T1G.pdf; Author: CERN DEM JLC; CreateDate: 05/12/2012; LatestRevisionDate: 05/12/2012
P1 = CMP-0001-00058-2: Golden finger, AMC, Dual, Opposite, Pitch 0.75mm, 170-Position; Package Version: rev2.0, Nov-2006; Mating Connector: Molex-0758000001; Datasheet Version: rev2.0, Nov-2006; ClassName: Edge Connector; Package Reference: AMC-GF-2D-750-O274; Publisher: Altium
R320 R321 = R1206_100K_1%_0.25W_100PPM: Resistor - 1%; Part Description: General Purpose Thick Film Chip Resistor; Manufacturer: GENERIC; Manufacturer1 Part Number: NRC12F1003TRF; Power: 0.25W; TC: ±100ppm/°C; Table: Resistors SMD; Part Number: R1206_100K_1%_0.25W_100PPM; Component Kind: Standard; Component Type: Standard; Pin Count: 2; Value: 100k; Status: Preferred; Tolerance: ±1%; Manufacturer Part Number: R1206_100K_1%_0.25W_100PPM; Case: 1206; Mounted: Yes; Socket: No; SMD: Yes; Manufacturer1 Example: NIC COMPONENT; Manufacturer1 ComponentHeight: 0.65mm; HelpURL: \\cern.ch\dfs\Applications\Altium\Datasheets\R1206_NIC_NRC.pdf; Author: CERN DEM JLC; CreateDate: 2007-12-03; LatestRevisionDate: 2008-03-13

## Sheet FPGA.SchDoc
size A3; DocumentNumber: 4; SheetNumber: 4; SheetTotal: 30
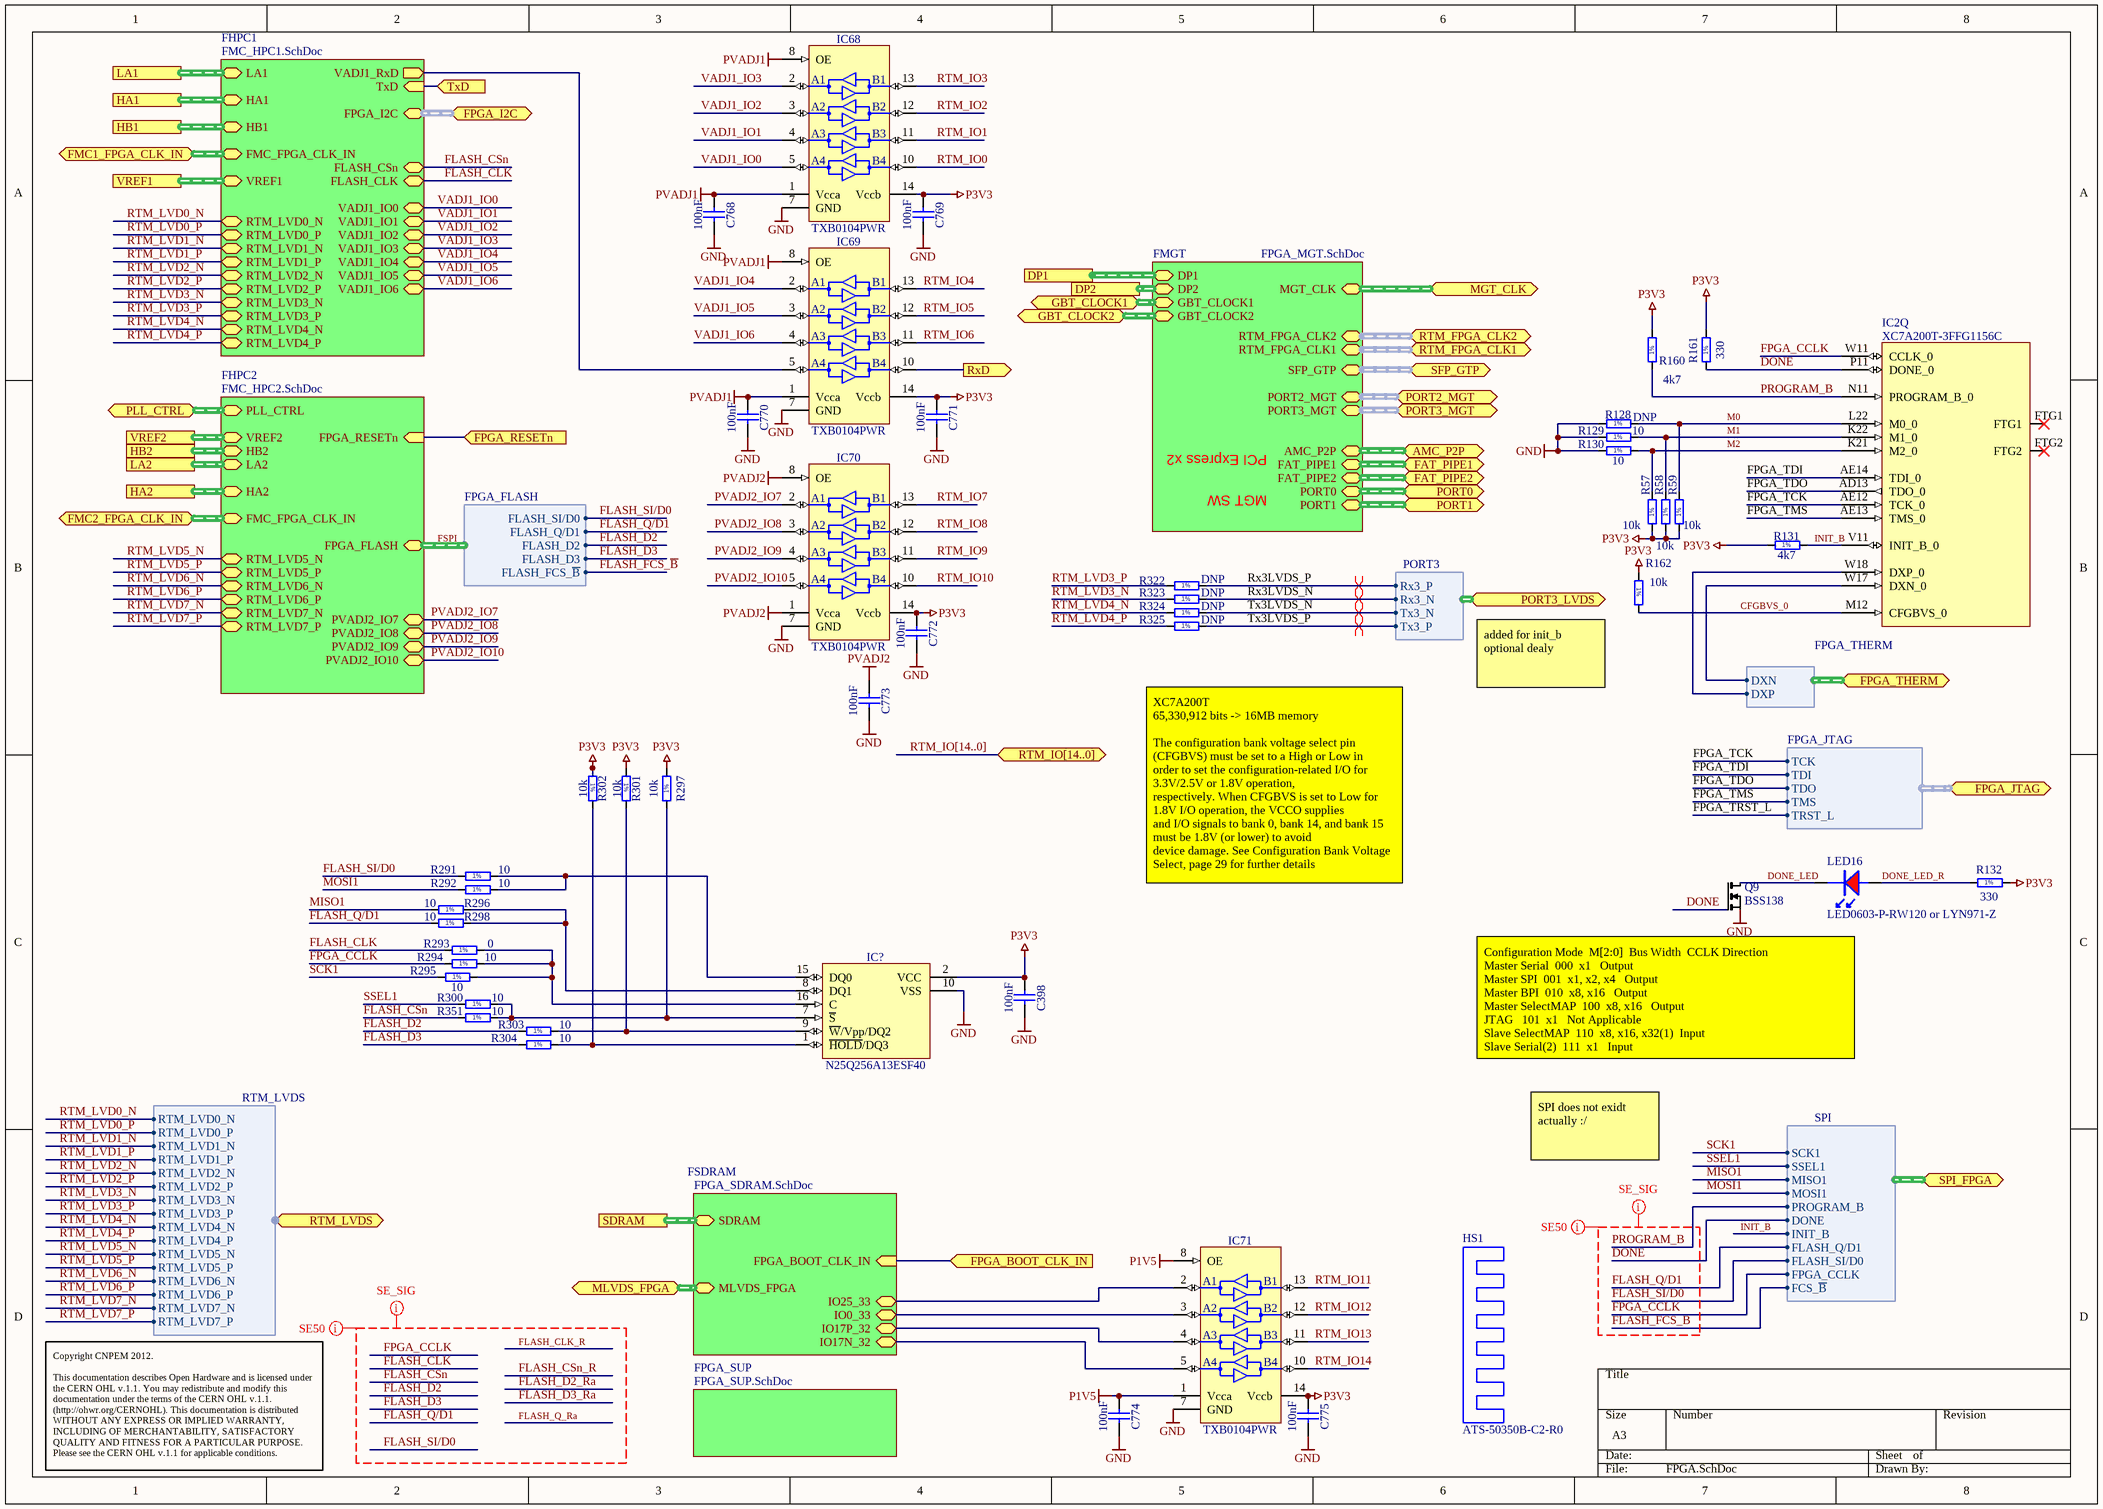
[diagram p2: FPGA.SchDoc]

### Parts
(Parts that share a designator on the sheet are numbered #1, #2 ... from top to bottom, then left to right.)
C398  100nF  [CAPC0603X33N]
C768  100nF  [CAPC0603X33N]
C769  100nF  [CAPC0603X33N]
C770  100nF  [CAPC0603X33N]
C771  100nF  [CAPC0603X33N]
C772  100nF  [CAPC0603X33N]
C773  100nF  [CAPC0603X33N]
C774  100nF  [CAPC0603X33N]
C775  100nF  [CAPC0603X33N]
HS1  ATS-50350B-C2-R0  [HEAT_SINK_ATS-50350B-C2-R0]
IC2#1  XC7A200T-3FFG1156C  [BGA1156C100P34X34_3500X3500X335]  (part Q of 23)
IC68  TXB0104PWR  [SOP65P640X120-14N]
IC69  TXB0104PWR  [SOP65P640X120-14N]
IC70  TXB0104PWR  [SOP65P640X120-14N]
IC71  TXB0104PWR  [SOP65P640X120-14N]
IC?#1  N25Q256A13ESF40  [SOIC127P1032X265-16N]
LED16  LED0603-P-RW120 or LYN971-Z  [led_0603R]
Q9  BSS138  [SOT95P251X112-3N]
R57  10k  [RESC1005X40N]
R58  10k  [RESC1005X40N]
R59  10k  [RESC1005X40N]
R128  DNP  [RESC1005X40N]
R129  10  [RESC1005X40N]
R130  10  [RESC1005X40N]
R131  4k7  [RESC1005X40N]
R132  330  [RESC1005X40N]
R160  4k7  [RESC1005X40N]
R161  330  [RESC1005X40N]
R162  10k  [RESC1005X40N]
R291  10  [RESC1005X40N]
R292  10  [RESC1005X40N]
R293  0  [RESC1005X40N]
R294  10  [RESC1005X40N]
R295  10  [RESC1005X40N]
R296  10  [RESC1005X40N]
R297  10k  [RESC1005X40N]
R298  10  [RESC1005X40N]
R300  10  [RESC1005X40N]
R301  10k  [RESC1005X40N]
R302  10k  [RESC1005X40N]
R303  10  [RESC1005X40N]
R304  10  [RESC1005X40N]
R322  DNP  [RESC1005X40N]
R323  DNP  [RESC1005X40N]
R324  DNP  [RESC1005X40N]
R325  DNP  [RESC1005X40N]
R351  10  [RESC1005X40N]

### Sub-sheets
FHPC1 = FMC_HPC1.SchDoc (file not in this document): LA1 (harness FMC_J1_LA), HA1 (harness FMC_J1_HA), HB1 (harness FMC_J1_HB), VREF1 (harness FMC_J1_VREF), FMC_FPGA_CLK_IN (harness FMC_FPGA_CLK_IN), FPGA_I2C (harness I2C), FLASH_CLK, FLASH_CSn, VADJ1_RxD (out), TxD (in), VADJ1_IO0, VADJ1_IO1, VADJ1_IO2, VADJ1_IO3, VADJ1_IO4, VADJ1_IO5, VADJ1_IO6, RTM_LVD0_N (bidir), RTM_LVD0_P (bidir), RTM_LVD1_N (bidir), RTM_LVD1_P (bidir), RTM_LVD2_N (bidir), RTM_LVD2_P (bidir), RTM_LVD3_N (bidir), RTM_LVD3_P (bidir), RTM_LVD4_N (bidir), RTM_LVD4_P (bidir)
FHPC2 = FMC_HPC2.SchDoc (file not in this document): VREF2 (harness FMC_J1_VREF), HB2 (harness FMC_J1_HB), LA2 (harness FMC_J1_LA), HA2 (harness FMC_J1_HA), FPGA_FLASH (harness FPGA_FLASH), FMC_FPGA_CLK_IN (harness FMC_FPGA_CLK_IN), PLL_CTRL (harness PLL_CTRL), FPGA_RESETn (in), PVADJ2_IO7, PVADJ2_IO8, PVADJ2_IO9, PVADJ2_IO10, RTM_LVD5_N (bidir), RTM_LVD5_P (bidir), RTM_LVD6_N (bidir), RTM_LVD6_P (bidir), RTM_LVD7_N (bidir), RTM_LVD7_P (bidir)
FMGT = FPGA_MGT.SchDoc (file not in this document): DP1 (harness FMC_J1_DP), DP2 (harness FMC_J1_DP), FAT_PIPE1 (harness FAT_PIPE1), FAT_PIPE2 (harness FAT_PIPE2), PORT0 (harness PORT0), PORT1 (harness PORT1), GBT_CLOCK1 (harness GBT_CLOCK), GBT_CLOCK2 (harness GBT_CLOCK), MGT_CLK (harness MGT_CLK), PORT2_MGT, PORT3_MGT, SFP_GTP, RTM_FPGA_CLK2 (harness CLK_DIFF), RTM_FPGA_CLK1 (harness CLK_DIFF), AMC_P2P
FPGA_SUP = FPGA_SUP.SchDoc (file not in this document): no entries
FSDRAM = FPGA_SDRAM.SchDoc: SDRAM (harness DDR), MLVDS_FPGA (harness MLVDS-FPGA), IO25_33 (bidir), IO0_33 (bidir), IO17N_32 (bidir), IO17P_32 (bidir), FPGA_BOOT_CLK_IN (in)

### Ports
AMC_P2P (harness AMC_P2P), DP1, DP2, FAT_PIPE1, FAT_PIPE2, FMC1_FPGA_CLK_IN, FMC2_FPGA_CLK_IN, FPGA_BOOT_CLK_IN (in), FPGA_I2C (harness I2C), FPGA_JTAG (harness FPGA_JTAG), FPGA_RESETn (in), FPGA_THERM (harness FPGA_THERM), GBT_CLOCK1, GBT_CLOCK2, HA1, HA2, HB1, HB2, LA1, LA2, MGT_CLK, MLVDS_FPGA, PLL_CTRL (harness PLL_CTRL), PORT0, PORT1, PORT2_MGT (harness PORT2), PORT3_LVDS (harness PORT3), PORT3_MGT (harness PORT3), RTM_FPGA_CLK1 (harness CLK_DIFF), RTM_FPGA_CLK2 (harness CLK_DIFF), RTM_IO[14..0] (bidir), RTM_LVDS (harness RTM_LVDS), RxD (out), SDRAM (harness DDR), SFP_GTP (harness SFP_GTP), SPI_FPGA (harness SPI), TxD (in), VREF1 (harness FMC_J1_VREF), VREF2 (harness FMC_J1_VREF)

### Harnesses
FPGA_JTAG: TCK, TDI, TDO, TMS, TRST_L
FPGA_THERM: DXN, DXP
SPI: SCK1, SSEL1, MISO1, MOSI1, FLASH_Q/D1, FLASH_SI/D0, PROGRAM_B, DONE, FPGA_CCLK, FCS_~{B}, INIT_B
FPGA_FLASH: FLASH_FCS_~{B}, FLASH_D3, FLASH_D2, FLASH_Q/D1, FLASH_SI/D0
RTM_LVDS: RTM_LVD0_N, RTM_LVD0_P, RTM_LVD1_N, RTM_LVD1_P, RTM_LVD2_N, RTM_LVD2_P, RTM_LVD3_N, RTM_LVD3_P, RTM_LVD4_N, RTM_LVD4_P, RTM_LVD5_N, RTM_LVD5_P, RTM_LVD6_N, RTM_LVD6_P, RTM_LVD7_N, RTM_LVD7_P
PORT3: Rx3_P, Rx3_N, Tx3_N, Tx3_P

### Nets
GND: C398.2 C768.2 C769.2 C770.2 C771.2 C772.2 C773.2 C774.2 C775.2 IC68.7(GND) IC69.7(GND) IC70.7(GND) IC71.7(GND) IC?#1.10(VSS) Q9.2(S) R128.1 R129.1 R130.1
P1V5: C774.1 IC71.1(Vcca) IC71.8(OE)
P3V3: C398.1 C769.1 C771.1 C772.1 C775.1 IC68.14(Vccb) IC69.14(Vccb) IC70.14(Vccb) IC71.14(Vccb) IC?#1.2(VCC) R57.1 R58.1 R59.1 R131.1 R132.2 R160.2 R161.2 R162.1 R297.2 R301.1 R302.1
PVADJ1: C768.1 C770.1 IC68.1(Vcca) IC68.8(OE) IC69.1(Vcca) IC69.8(OE)
PVADJ2: C773.1 IC70.1(Vcca) IC70.8(OE)
CFGBVS_0: IC2#1.M12(CFGBVS_0) R162.2
DONE: IC2#1.P11(DONE_0) Q9.1(G) R161.1 ; port SPI_FPGA.DONE  [project net FSPI.DONE]
DONE_LED: LED16.K Q9.3(D)
DONE_LED_R: LED16.A R132.1
FLASH_CLK: R293.1 ; sheet FHPC1/FLASH_CLK
FLASH_CSn: R351.1 ; sheet FHPC1/FLASH_CSn
FLASH_D2: R303.1 ; sheet FHPC2/FPGA_FLASH.FLASH_D2  [project net FSPI.FLASH_D2]
FLASH_D3: R304.1 ; sheet FHPC2/FPGA_FLASH.FLASH_D3  [project net FSPI.FLASH_D3]
FLASH_FCS_~{B}: port SPI_FPGA.FCS_~{B}, sheet FHPC2/FPGA_FLASH.FLASH_FCS_~{B}  [project net FSPI.FCS_~{B}]
FLASH_Q/D1: R298.2 ; port SPI_FPGA.FLASH_Q/D1, sheet FHPC2/FPGA_FLASH.FLASH_Q/D1  [project net FSPI.FLASH_Q/D1]
FLASH_SI/D0: R291.1 ; port SPI_FPGA.FLASH_SI/D0, sheet FHPC2/FPGA_FLASH.FLASH_SI/D0  [project net FSPI.FLASH_SI/D0]
FPGA_BOOT_CLK_IN: port FPGA_BOOT_CLK_IN, sheet FSDRAM/FPGA_BOOT_CLK_IN
FPGA_CCLK: IC2#1.W11(CCLK_0) R294.1 ; port SPI_FPGA.FPGA_CCLK  [project net FSPI.FPGA_CCLK]
FPGA_RESETn: port FPGA_RESETn, sheet FHPC2/FPGA_RESETn
FPGA_TCK: IC2#1.AE12(TCK_0) ; port FPGA_JTAG.TCK  [project net FJTAG.TCK]
FPGA_TDI: IC2#1.AE14(TDI_0) ; port FPGA_JTAG.TDI  [project net FJTAG.TDI]
FPGA_TDO: IC2#1.AD13(TDO_0) ; port FPGA_JTAG.TDO  [project net FJTAG.TDO]
FPGA_TMS: IC2#1.AE13(TMS_0) ; port FPGA_JTAG.TMS  [project net FJTAG.TMS]
FTMP.DXN: IC2#1.W17(DXN_0) ; port FPGA_THERM.DXN
FTMP.DXP: IC2#1.W18(DXP_0) ; port FPGA_THERM.DXP
INIT_B: IC2#1.V11(INIT_B_0) R131.2 ; port SPI_FPGA.INIT_B  [project net FSPI.INIT_B]
IO0_33: IC71.3(A2) ; sheet FSDRAM/IO0_33
IO17N_32: IC71.5(A4) ; sheet FSDRAM/IO17N_32
IO17P_32: IC71.4(A3) ; sheet FSDRAM/IO17P_32
IO25_33: IC71.2(A1) ; sheet FSDRAM/IO25_33
M0: IC2#1.L22(M0_0) R59.2 R128.2
M1: IC2#1.K22(M1_0) R58.2 R129.2
M2: IC2#1.K21(M2_0) R57.2 R130.2
MISO1: R296.2 ; port SPI_FPGA.MISO1  [project net FSPI.MISO1]
MOSI1: R292.1 ; port SPI_FPGA.MOSI1  [project net FSPI.MOSI1]
PROGRAM_B: IC2#1.N11(PROGRAM_B_0) R160.1 ; port SPI_FPGA.PROGRAM_B  [project net FSPI.PROGRAM_B]
PVADJ2_IO7: IC70.2(A1) ; sheet FHPC2/PVADJ2_IO7
PVADJ2_IO8: IC70.3(A2) ; sheet FHPC2/PVADJ2_IO8
PVADJ2_IO9: IC70.4(A3) ; sheet FHPC2/PVADJ2_IO9
PVADJ2_IO10: IC70.5(A4) ; sheet FHPC2/PVADJ2_IO10
RTM_IO0: IC68.10(B4)
RTM_IO1: IC68.11(B3)
RTM_IO2: IC68.12(B2)
RTM_IO3: IC68.13(B1)
RTM_IO4: IC69.13(B1)
RTM_IO5: IC69.12(B2)
RTM_IO6: IC69.11(B3)
RTM_IO7: IC70.13(B1)
RTM_IO8: IC70.12(B2)
RTM_IO9: IC70.11(B3)
RTM_IO10: IC70.10(B4)
RTM_IO11: IC71.13(B1)
RTM_IO12: IC71.12(B2)
RTM_IO13: IC71.11(B3)
RTM_IO14: IC71.10(B4)
RTM_LVD0_N: sheet FHPC1/RTM_LVD0_N, port RTM_LVDS.RTM_LVD0_N  [project net RTM_LVDS.RTM_LVD0_N]
RTM_LVD0_P: sheet FHPC1/RTM_LVD0_P, port RTM_LVDS.RTM_LVD0_P  [project net RTM_LVDS.RTM_LVD0_P]
RTM_LVD1_N: sheet FHPC1/RTM_LVD1_N, port RTM_LVDS.RTM_LVD1_N  [project net RTM_LVDS.RTM_LVD1_N]
RTM_LVD1_P: sheet FHPC1/RTM_LVD1_P, port RTM_LVDS.RTM_LVD1_P  [project net RTM_LVDS.RTM_LVD1_P]
RTM_LVD2_N: sheet FHPC1/RTM_LVD2_N, port RTM_LVDS.RTM_LVD2_N  [project net RTM_LVDS.RTM_LVD2_N]
RTM_LVD2_P: sheet FHPC1/RTM_LVD2_P, port RTM_LVDS.RTM_LVD2_P  [project net RTM_LVDS.RTM_LVD2_P]
RTM_LVD3_N: R323.1 ; sheet FHPC1/RTM_LVD3_N, port RTM_LVDS.RTM_LVD3_N  [project net RTM_LVDS.RTM_LVD3_N]
RTM_LVD3_P: R322.1 ; sheet FHPC1/RTM_LVD3_P, port RTM_LVDS.RTM_LVD3_P  [project net RTM_LVDS.RTM_LVD3_P]
RTM_LVD4_N: R324.1 ; sheet FHPC1/RTM_LVD4_N, port RTM_LVDS.RTM_LVD4_N  [project net RTM_LVDS.RTM_LVD4_N]
RTM_LVD4_P: R325.1 ; sheet FHPC1/RTM_LVD4_P, port RTM_LVDS.RTM_LVD4_P  [project net RTM_LVDS.RTM_LVD4_P]
RTM_LVD5_N: sheet FHPC2/RTM_LVD5_N, port RTM_LVDS.RTM_LVD5_N  [project net RTM_LVDS.RTM_LVD5_N]
RTM_LVD5_P: sheet FHPC2/RTM_LVD5_P, port RTM_LVDS.RTM_LVD5_P  [project net RTM_LVDS.RTM_LVD5_P]
RTM_LVD6_N: sheet FHPC2/RTM_LVD6_N, port RTM_LVDS.RTM_LVD6_N  [project net RTM_LVDS.RTM_LVD6_N]
RTM_LVD6_P: sheet FHPC2/RTM_LVD6_P, port RTM_LVDS.RTM_LVD6_P  [project net RTM_LVDS.RTM_LVD6_P]
RTM_LVD7_N: sheet FHPC2/RTM_LVD7_N, port RTM_LVDS.RTM_LVD7_N  [project net RTM_LVDS.RTM_LVD7_N]
RTM_LVD7_P: sheet FHPC2/RTM_LVD7_P, port RTM_LVDS.RTM_LVD7_P  [project net RTM_LVDS.RTM_LVD7_P]
Rx3LVDS_N: R323.2 ; port PORT3_LVDS.Rx3_N  [project net PORT3_LVDS.Rx3_N]
Rx3LVDS_P: R322.2 ; port PORT3_LVDS.Rx3_P  [project net PORT3_LVDS.Rx3_P]
RxD: IC69.10(B4) ; port RxD
SCK1: R295.1 ; port SPI_FPGA.SCK1  [project net FSPI.SCK1]
SSEL1: R300.1 ; port SPI_FPGA.SSEL1  [project net FSPI.SSEL1]
Tx3LVDS_N: R324.2 ; port PORT3_LVDS.Tx3_N  [project net PORT3_LVDS.Tx3_N]
Tx3LVDS_P: R325.2 ; port PORT3_LVDS.Tx3_P  [project net PORT3_LVDS.Tx3_P]
TxD: port TxD, sheet FHPC1/TxD
VADJ1_IO0: IC68.5(A4) ; sheet FHPC1/VADJ1_IO0
VADJ1_IO1: IC68.4(A3) ; sheet FHPC1/VADJ1_IO1
VADJ1_IO2: IC68.3(A2) ; sheet FHPC1/VADJ1_IO2
VADJ1_IO3: IC68.2(A1) ; sheet FHPC1/VADJ1_IO3
VADJ1_IO4: IC69.2(A1) ; sheet FHPC1/VADJ1_IO4
VADJ1_IO5: IC69.3(A2) ; sheet FHPC1/VADJ1_IO5
VADJ1_IO6: IC69.4(A3) ; sheet FHPC1/VADJ1_IO6
NetIC69_5: IC69.5(A4) ; sheet FHPC1/VADJ1_RxD
NetIC?#1_1: IC?#1.1(~{HOLD}/DQ3) R302.2 R304.2
NetIC?#1_7: IC?#1.7(~{S}) R297.1 R300.2 R351.2
NetIC?#1_8: IC?#1.8(DQ1) R296.1 R298.1
NetIC?#1_9: IC?#1.9(~{W}/Vpp/DQ2) R301.2 R303.2
NetIC?#1_15: IC?#1.15(DQ0) R291.2 R292.2
NetIC?#1_16: IC?#1.16(C) R293.2 R294.2 R295.2

Not connected (* = marked no-connect by the designer): IC2#1 FTG1* FTG2*

### Buses and harness runs
bus RTM_IO[14..0] = port RTM_IO[14..0]
harness FSPI = sheet FHPC2/FPGA_FLASH
harness port AMC_P2P = sheet FMGT/AMC_P2P
harness port DP1 = sheet FMGT/DP1
harness port DP2 = sheet FMGT/DP2
harness port FAT_PIPE1 = sheet FMGT/FAT_PIPE1
harness port FAT_PIPE2 = sheet FMGT/FAT_PIPE2
harness port FMC1_FPGA_CLK_IN = sheet FHPC1/FMC_FPGA_CLK_IN
harness port FMC2_FPGA_CLK_IN = sheet FHPC2/FMC_FPGA_CLK_IN
harness port FPGA_I2C = sheet FHPC1/FPGA_I2C
harness port GBT_CLOCK1 = sheet FMGT/GBT_CLOCK1
harness port GBT_CLOCK2 = sheet FMGT/GBT_CLOCK2
harness port HA1 = sheet FHPC1/HA1
harness port HA2 = sheet FHPC2/HA2
harness port HB1 = sheet FHPC1/HB1
harness port HB2 = sheet FHPC2/HB2
harness port LA1 = sheet FHPC1/LA1
harness port LA2 = sheet FHPC2/LA2
harness port MGT_CLK = sheet FMGT/MGT_CLK
harness port MLVDS_FPGA = sheet FSDRAM/MLVDS_FPGA
harness port PLL_CTRL = sheet FHPC2/PLL_CTRL
harness port PORT0 = sheet FMGT/PORT0
harness port PORT1 = sheet FMGT/PORT1
harness port PORT2_MGT = sheet FMGT/PORT2_MGT
harness port PORT3_MGT = sheet FMGT/PORT3_MGT
harness port RTM_FPGA_CLK1 = sheet FMGT/RTM_FPGA_CLK1
harness port RTM_FPGA_CLK2 = sheet FMGT/RTM_FPGA_CLK2
harness port SDRAM = sheet FSDRAM/SDRAM
harness port SFP_GTP = sheet FMGT/SFP_GTP
harness port VREF1 = sheet FHPC1/VREF1
harness port VREF2 = sheet FHPC2/VREF2

### Layout directives
net class SE_SIG: DONE, FLASH_CLK, FLASH_CLK_R, FLASH_CSn, FLASH_CSn_R, FLASH_D2, FLASH_D2_Ra, FLASH_D3, FLASH_D3_Ra, FLASH_FCS_~{B}, FLASH_Q/D1, FLASH_Q_Ra, FLASH_SI/D0, FPGA_CCLK, PROGRAM_B
net class SE50: DONE, FLASH_CLK, FLASH_CLK_R, FLASH_CSn, FLASH_CSn_R, FLASH_D2, FLASH_D2_Ra, FLASH_D3, FLASH_D3_Ra, FLASH_FCS_~{B}, FLASH_Q/D1, FLASH_Q_Ra, FLASH_SI/D0, FPGA_CCLK, PROGRAM_B
differential pair: PORT3_LVDS.Rx3_N, PORT3_LVDS.Rx3_P, PORT3_LVDS.Tx3_N, PORT3_LVDS.Tx3_P

### Notes on the sheet
- PCI Express x2
- MGT SW
- (near R162) added for init_b optional dealy
- XC7A200T
  65,330,912 bits -> 16MB memory
  The configuration bank voltage select pin (CFGBVS) must be set to a High or Low in
  order to set the configuration-related I/O for 3.3V/2.5V or 1.8V operation,
  respectively. When CFGBVS is set to Low for 1.8V I/O operation, the VCCO supplies
  and I/O signals to bank 0, bank 14, and bank 15 must be 1.8V (or lower) to avoid
  device damage. See Configuration Bank Voltage Select, page 29 for further details
- (near Q9) Configuration Mode 	M[2:0] 	Bus Width 	CCLK Direction
  Master Serial 	000 	x1 		Output
  Master SPI 	001 	x1, x2, x4 		Output
  Master BPI 	010 	x8, x16 		Output
  Master SelectMAP 	100 	x8, x16 		Output
  JTAG 		101 	x1 		Not Applicable
  Slave SelectMAP 	110	 x8, x16, x32(1) 	Input
  Slave Serial(2) 	111 	x1 		Input
- SPI does not exidt actually :/
- Copyright CNPEM 2012.
  This documentation describes Open Hardware and is licensed under the CERN OHL v.1.1. You may redistribute and modify this documentation under the terms of the CERN OHL v.1.1. (http://ohwr.org/CERNOHL). This documentation is distributed WITHOUT ANY EXPRESS OR IMPLIED WARRANTY, INCLUDING OF MERCHANTABILITY, SATISFACTORY QUALITY AND FITNESS FOR A PARTICULAR PURPOSE. Please see the CERN OHL v.1.1 for applicable conditions.
- (in symbol R0402_0R_JUMPER) 1%
- (in symbol R0402_4K7_1%_0.0625W_100PPM) 1%
- (in symbol R0402_10K_1%_0.0625W_100PPM) 1%
- (in symbol R0402_10R_1%_0.0625W_200PPM) 1%
- (in symbol R0402_330R_1%_0.0625W_100PPM) 1%

### Library data of the parts
C398 C768-C775 = CC0201_100NF_6.3V_10%_X5R: Non-polarised capacitor; Part Description: SMD Multilayer Chip Ceramic Capacitor; Manufacturer: GENERIC; Manufacturer1 Part Number: 02016D104KAT2A; Voltage: 6.3V; TC: X5R; Tolerance: ±10%; Table: Capacitors SMD; Part Number: CC0201_100NF_6.3V_10%_X5R; Component Kind: Standard; Component Type: Standard; Pin Count: 2; Value: 100nF; Status: Not Recommended; Manufacturer Part Number: CC0201_100NF_6.3V_10%_X5R; Case: 0201; Mounted: Yes; Socket: No; SMD: Yes; Manufacturer1 Example: AVX; Manufacturer1 ComponentHeight: 0.33mm; HelpURL: \\cern.ch\dfs\Applications\Altium\Datasheets\CC0201_X5R_AVX.pdf; Author: CERN DEM JLC; CreateDate: 2007-12-03; LatestRevisionDate: 2007-12-03
HS1 = HEAT_SINK_ATS-50350B-C2-R0: Heat sink BGA 35x35(44.9)mm
IC2#1 = XC7A350T-2FFG1156C: Artix-6 FPGA, 16 GTPs, 600 User I/Os, 1156-Pin BGA, Speed Grade 2, Commercial Grade, Pb-Free; Part Description: Artix-7 FPGA, 16 GTPs, 600 User I/Os, 1156-Pin BGA, Speed Grade 2, Commercial Grade, Pb-Free; Manufacturer: XILINX; Table: Logic; Part Number: XC7A200T-3FFG1156C; Component Kind: Standard; Component Type: Standard; Device: XC7A200T-3FFG1156C; PackageDescription: BGA, 1.00mm Pitch, Square; 1156 Pin, 34 Columns X 34 Rows, 35.00mm X 35.00mm X 3.350mm H; Manufacturer Part Number: XC7A200T-3FFG1156C; Pin Count: 1156; Case: BGA1156; Mounted: Yes; Socket: No; SMD: Yes; ComponentHeight: 3.35mm; HelpURL: \\cern.ch\dfs\Applications\Altium\Datasheets\XC7A350T-2FFG1156C.pdf; ComponentLink1URL: \\cern.ch\dfs\Applications\Altium\Datasheets\XC7A350T-2FFG1156C.pdf; ComponentLink1Description: Package/Pinout; Author: CERN DEM JLC; CreateDate: 2012-09-19; LatestRevisionDate: 2012-09-19
IC68-IC71 = TXB0104PWR: 4-Bit Bidirectionnal Voltage-Level Translator; Part Description: 4-Bit Bidirectional Voltage-Level Translator with Automatic Direction Sensing and ±15kV ESD Protection; Manufacturer: TEXAS INSTRUMENTS; Table: Analog & Interface; Part Number: TXB0104PWR; Component Kind: Standard; Component Type: Standard; Device: TXB0104PWR; PackageDescription: SOP, 14-Leads, Body 5.1x4.5mm (max), Pitch 0.65mm, IPC Medium Density; Manufacturer Part Number: TXB0104PWR; Pin Count: 14; Case: TSSOP14; Mounted: Yes; Socket: No; SMD: Yes; ComponentHeight: 1.2mm; Author: CERN DEM JMW; HelpURL: \\cern.ch\dfs\Applications\Altium\Datasheets\TXB0104PWR.pdf; CreateDate: 2010-12-20; LatestRevisionDate: 2010-12-20
IC?#1 = N25Q256A13ESF40: 256Mb, 3V, Multiple I/O Serial Flash Memory; Part Description: 256Mb, 2.7 to 3.6V, Multiple I/O Serial Flash Memory; Manufacturer: MICRON TECHNOLOGY; PressFit: No; Bonding: No; Part Number: N25Q256A13ESF40; Component Kind: Standard; Component Type: Standard; Device: N25Q256A13ESF40; PackageDescription: SOIC, 1.27mm Pitch; 16 Pin, Body 7.5x10.3mm, IPC Medium Density; Manufacturer Part Number: N25Q256A13ESF40; Pin Count: 16; Case: SOIC16; Mounted: Yes; Socket: No; SMD: Yes; Sense: No; ComponentHeight: 2.65mm; HelpURL: \\cern.ch\dfs\Applications\Altium\Datasheets\N25Q256A13ESF40.pdf; Author: CERN DEM BC; CreateDate: 04/09/2015; LatestRevisionDate: 04/09/2015
LED16 = LED_0603R: LED 0603 red; Supplier 1: Newark; Supplier Part Number 1: 22M3004; Supplier 2: Newark; Supplier Part Number 2: 20M0618
Q9 = Q_BSS138
R57-R59 R162 = R0402_10K_1%_0.0625W_100PPM: Resistor - 1%; Part Description: General Purpose Thick Film Chip Resistor; Manufacturer: GENERIC; Manufacturer1 Part Number: 232270671003L; TC: ±100ppm/°C; Table: Resistors SMD; Part Number: R0402_10K_1%_0.0625W_100PPM; Component Kind: Standard; Component Type: Standard; Pin Count: 2; Value: 10k; Status: Not recommended; Power: 0.0625W; Tolerance: ±1%; Manufacturer Part Number: R0402_10K_1%_0.0625W_100PPM; Case: 0402; Mounted: Yes; Socket: No; SMD: Yes; Manufacturer1 Example: YAGEO PHYCOMP; Manufacturer1 ComponentHeight: 0.4mm; HelpURL: \\cern.ch\dfs\Applications\Altium\Datasheets\R0402_Phycomp_RC0402.pdf; Author: CERN DEM JLC; CreateDate: 2007-12-03; LatestRevisionDate: 2012-10-17
R128 R322-R325 = R0402_0R_JUMPER: Resistor - 1%; Part Description: 1A (0.05R Max DC Resistance) Zero Ohm Jumper; Manufacturer: GENERIC; Manufacturer1 Part Number: 232270591001L; Value: 0; Table: Resistors SMD; Part Number: R0402_0R_JUMPER; Component Kind: Standard; Component Type: Standard; Pin Count: 2; Status: Not recommended; Manufacturer Part Number: R0402_0R_JUMPER; Case: 0402; Mounted: Yes; Socket: No; SMD: Yes; Manufacturer1 Example: YAGEO PHYCOMP; Manufacturer1 ComponentHeight: 0.4mm; HelpURL: \\cern.ch\dfs\Applications\Altium\Datasheets\R0402_Phycomp_RC0402.pdf; Author: CERN DEM JLC; CreateDate: 2007-12-03; LatestRevisionDate: 2012-10-17
R129 R130 R291 R292 R294-R296 R298 R300 R303 R304 R351 = R0402_10R_1%_0.0625W_200PPM: Resistor - 1%; Part Description: General Purpose Thick Film Chip Resistor; Manufacturer: GENERIC; Manufacturer1 Part Number: 232270671009L; TC: ±200ppm/°C; Table: Resistors SMD; Part Number: R0402_10R_1%_0.0625W_200PPM; Component Kind: Standard; Component Type: Standard; Pin Count: 2; Value: 10; Status: Not recommended; Power: 0.0625W; Tolerance: ±1%; Manufacturer Part Number: R0402_10R_1%_0.0625W_200PPM; Case: 0402; Mounted: Yes; Socket: No; SMD: Yes; Manufacturer1 Example: YAGEO PHYCOMP; Manufacturer1 ComponentHeight: 0.4mm; HelpURL: \\cern.ch\dfs\Applications\Altium\Datasheets\R0402_Phycomp_RC0402.pdf; Author: CERN DEM JLC; CreateDate: 2009-06-24; LatestRevisionDate: 2012-10-17
R131 R160 = R0402_4K7_1%_0.0625W_100PPM: Resistor - 1%; Part Description: General Purpose Thick Film Chip Resistor; Manufacturer: GENERIC; Manufacturer1 Part Number: 232270674702L; TC: ±100ppm/°C; Table: Resistors SMD; Part Number: R0402_4K7_1%_0.0625W_100PPM; Component Kind: Standard; Component Type: Standard; Pin Count: 2; Value: 4k7; Status: Not recommended; Power: 0.0625W; Tolerance: ±1%; Manufacturer Part Number: R0402_4K7_1%_0.0625W_100PPM; Case: 0402; Mounted: Yes; Socket: No; SMD: Yes; Manufacturer1 Example: YAGEO PHYCOMP; Manufacturer1 ComponentHeight: 0.4mm; HelpURL: \\cern.ch\dfs\Applications\Altium\Datasheets\R0402_Phycomp_RC0402.pdf; Author: CERN DEM JLC; CreateDate: 2007-12-03; LatestRevisionDate: 2012-10-17
R132 R161 = R0402_330R_1%_0.0625W_100PPM: Resistor - 1%; Part Description: General Purpose Thick Film Chip Resistor; Manufacturer: GENERIC; Manufacturer1 Part Number: 232270673301L; TC: ±100ppm/°C; Table: Resistors SMD; Part Number: R0402_330R_1%_0.0625W_100PPM; Component Kind: Standard; Component Type: Standard; Pin Count: 2; Value: 330; Status: Not recommended; Power: 0.0625W; Tolerance: ±1%; Manufacturer Part Number: R0402_330R_1%_0.0625W_100PPM; Case: 0402; Mounted: Yes; Socket: No; SMD: Yes; Manufacturer1 Example: YAGEO PHYCOMP; Manufacturer1 ComponentHeight: 0.4mm; HelpURL: \\cern.ch\dfs\Applications\Altium\Datasheets\R0402_Phycomp_RC0402.pdf; Author: CERN DEM JLC; CreateDate: 2007-12-03; LatestRevisionDate: 2012-10-17
R293 = R0402_0R_JUMPER: as R124 on sheet AMC_FMC_Carrier; Part Number: R0402_0R_JUMPER; Component Kind: Standard; Component Type: Standard; Pin Count: 2; Value: 0; Status: Not recommended; Manufacturer Part Number: R0402_0R_JUMPER; Case: 0402; Mounted: Yes; Socket: No; SMD: Yes; Manufacturer1 Example: YAGEO PHYCOMP; Manufacturer1 ComponentHeight: 0.4mm; HelpURL: \\cern.ch\dfs\Applications\Altium\Datasheets\R0402_Phycomp_RC0402.pdf; Author: CERN DEM JLC; CreateDate: 2007-12-03; LatestRevisionDate: 2012-10-17
R297 R301 R302 = R0402_10K_1%_0.0625W_100PPM: Resistor - 1%; Part Description: General Purpose Thick Film Chip Resistor; Manufacturer: GENERIC; Manufacturer1 Part Number: 232270671003L; TC: ±100ppm/°C; Part Number: R0402_10K_1%_0.0625W_100PPM; Component Kind: Standard; Component Type: Standard; Pin Count: 2; Value: 10k; Status: Not recommended; Power: 0.0625W; Tolerance: ±1%; Manufacturer Part Number: R0402_10K_1%_0.0625W_100PPM; Case: 0402; Mounted: Yes; Socket: No; SMD: Yes; Manufacturer1 Example: YAGEO PHYCOMP; Manufacturer1 ComponentHeight: 0.4mm; HelpURL: \\cern.ch\dfs\Applications\Altium\Datasheets\R0402_Phycomp_RC0402.pdf; Author: CERN DEM JLC; CreateDate: 03/12/2007; LatestRevisionDate: 17/10/2012; Sense: No